# Altium project BÀI_1.PrjPcb (part 2 of 2)

## Sheet Buck-Bost_2.SchDoc
size A4; SheetNumber: 8; SheetTotal: 10
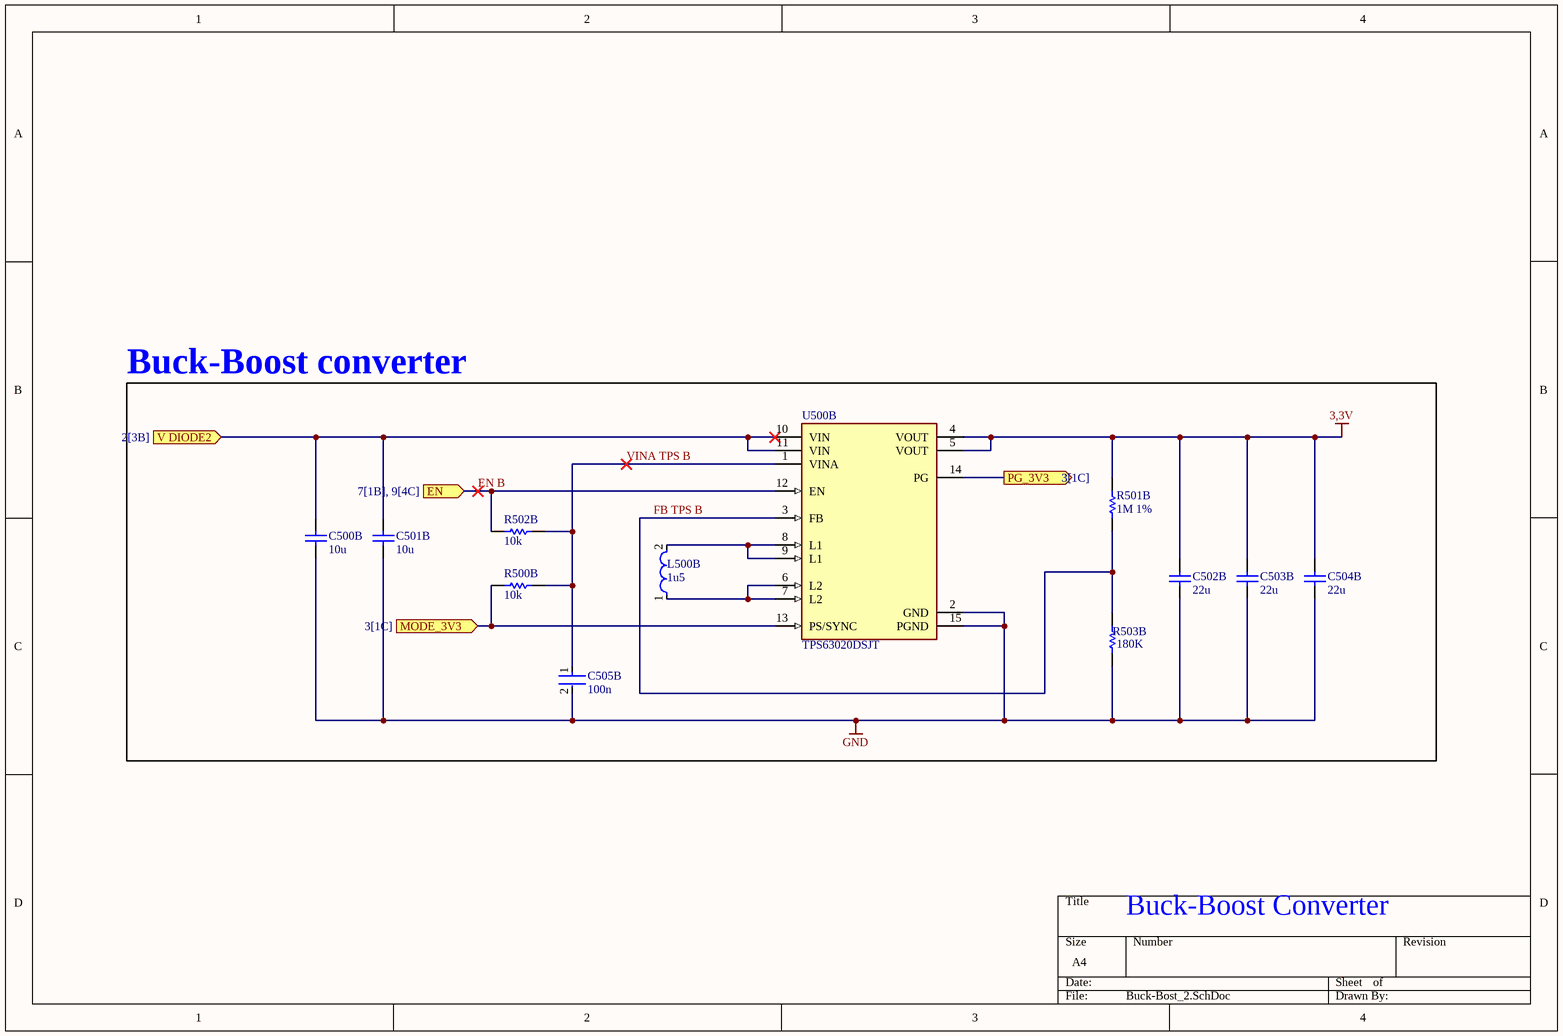
[diagram p7: Buck-Bost_2.SchDoc]

### Parts
C500B  10u  [CAPC3216X180X50LL20T25]
C501B  10u  [CAPC3216X180X50LL20T25]
C502B  22u  [CAPC1206(3216)190_L]
C503B  22u  [CAPC1206(3216)190_L]
C504B  22u  [CAPC1206(3216)190_L]
C505B  100n  [FP-CGA3E-0_3-0_1-IPC_A]
L500B  1u5  [FP-DFE252010C-IPC_A]
R500B  10k  [RESC2013X60X35NL10T20]
R501B  1M 1%  [RESC1608X55X25LL10T15]
R502B  10k  [RESC2013X60X35NL10T20]
R503B  180K  [RESC1005X40X25NL05T10]
U500B  TPS63020DSJT  [FP-DSJ0014A-MFG]

### Blocks framed on the sheet
Buck-Boost converter: C500B C501B C502B C503B C504B C505B L500B R500B R501B R502B R503B U500B

### Ports
EN (in, see 7[1B], 9[4C]), MODE_3V3 (in, see 3[1C]), PG_3V3 (out, see 3[1C]), V DIODE2 (in, see 2[3B])

### Nets
3,3V: C502B.2 C503B.2 C504B.2 R501B.2 U500B.4(VOUT) U500B.5(VOUT)
GND: C500B.1 C501B.1 C502B.1 C503B.1 C504B.1 C505B.2 R503B.1 U500B.2(GND) U500B.15(PGND)
EN B: R502B.1 U500B.12(EN) ; port EN
FB TPS B: R501B.1 R503B.2 U500B.3(FB)
VINA TPS B: C505B.1 R500B.2 R502B.2 U500B.1(VINA)
NetC401B_1: C500B.2 C501B.2 U500B.10(VIN) U500B.11(VIN) ; port V DIODE2
NetL500B_1: L500B.1 U500B.6(L2) U500B.7(L2)
NetL500B_2: L500B.2 U500B.8(L1) U500B.9(L1)
NetR500B_1: R500B.1 U500B.13(PS/SYNC) ; port MODE_3V3
NetU200_24: U500B.14(PG) ; port PG_3V3

### Notes on the sheet
- Buck-Boost Converter

### Library data of the parts
C500B C501B = CMP-2000-06013-1: Chip Capacitor, 10 uF, +/- 10%, 10 V, -55 to 125 degC, 1206 (3216 Metric), RoHS, Tape and Reel; Type: SMDMLCCX7R6.3-250VDCCommericalGrade; Class: Class1; Case Height: 1.6mm; Temperature Coefficient / Code: +/-15%; Capacitance: 10uF; Brand: Kemet; Case Length: 3.2mm; Dissipation Factor DF: 5; Voltage Rating: 10V; Dielectric: X7R; Tolerance: 10%; Package Reference: 1206; Dimensions: 1.6mmWx3.2mmLx1.6mmH; Series: C1206C; Minimum Operating Temperature: -55C; RoHS: Details; Termination Style: SMD/SMT; Mounting Technology: SurfaceMount; Manufacturer: Kemet; Product Category: MultilayerCeramicCapacitorsMLCC-SMD/SMT; Case Code - mm: 3216; Manufacturer URL: http://www.kemet.com/; Product: GeneralTypeMLCCs; Package Description: 2-Pin Surface Mount Device, Body 3.2 x 1.6 mm; Case Width: 1.6mm; Factory Pack Quantity: 2000; Package / Case: 1206(3216metric); Datasheet URL: http://www.kemet.com/docfinder?Partnumber=C1206C106K8RACTU; Datasheet Version: 02/2016; Operating Temperature Range: -55Cto+125C; Voltage Rating DC: 10V; Case Code - in: 1206; Maximum Operating Temperature: +125C; Packaging: Reel
C502B C503B C504B = CMP-1037-04986-1: CAP 22uF 6.3V ±20% 1206 (3216 Metric) Thickness 1.9mm SMD; Case-EIA: 1206; Tolerance: Â±20%; Case-Metric: 3216; Value: 22uF; Max Thickness: 1.9 mm; Rated Voltage: 6.3 V; Technology: SMT
C505B = CMP-2000-07546-2: Cap Ceramic 100nF 50V X7R 10% Pad SMD 0603 +125°C Automotive T/R; Weight: 7.1E-05oz; Composition: Ceramic; Max Operating Temperature: 125°C; Termination: SMD/SMT; Dielectric: X7R; Length: 1.6mm; Package Quantity: 1; REACH SVHC: No SVHC; Lead Free: Lead Free; Case Code (Metric): 1608; Min Operating Temperature: -55°C; Packaging: Tape and Reel; Tolerance: 10%; Voltage Rating: 50V; Case Code (Imperial): 0603; Capacitance: 100nF; Case/Package: 0603; Voltage Rating (DC): 50V; Depth: 0.8mm; Radiation Hardening: No; Ratings: AEC-Q200; Mount: Surface Mount; Voltage: 50V; Thickness: 0.035inch; Width: 0.8mm; Height: 0.8mm
L500B = CMP-06042-006286-1: Shielded Wirewound Inductor 1.5uH  2500mA 0.072Ω 1008 (2520); Current Rating: 2.5A; DC Resistance (DCR): 72mR; Core Material: Ferrite; Test Frequency: 1MHz; Saturation Current: 3.8A; Tolerance: 20%; Width: 0.079inch; Case Code (Metric): 2520; Case/Package: 1008; Height - Seated (Max): 0.039inch; Min Operating Temperature: -40°C; Inductance: 1.5uH; Case Code (Imperial): 1008; Shielding: Shielded; Mount: Surface Mount; Length: 0.098inch; Packaging: Tape and Reel; Max Operating Temperature: 125°C
R500B R502B = CMP-1659-00013-4: Chip Resistor, 10 KOhm, +/- 1%, 0.125 W, -55 to 155 degC, 0805 (2012 Metric), RoHS, Tape and Reel; Manufacturer: Yageo; Voltage Rating: 150 V; Mount: Surface Mount; ComponentLink1Description: Manufacturer URL; ComponentLink2URL: http://www.yageo.com/documents/recent/PYu-RC_Group_51_RoHS_L_04.pdf; Pins: 2; Length: 2 mm; Min Operating Temperature: -55 degC; Height: 0.5 mm; Mounting Technology: Surface Mount; RoHSCompliant: true; REACH SVHC: No SVHC; ComponentLink1URL: http://www.yageo.com/; Max Operating Temperature: 155 degC; PackageReference: 0805; DatasheetVersion: Rev. 4, 02/2016; Package Quantity: 5000; Packaging: Tape and Reel; ComponentLink2Description: Datasheet; PackageDescription: 2-Pin Surface Mounted Device, Body 2 x 1.25 mm
R501B = CMP-1659-00056-1: Chip Resistor, 1 MOhm, +/- 1%, 100 mW, -55 to 155 degC, 0603 (1608 Metric), RoHS, Tape and Reel; Voltage Rating (DC): 25 V; Tolerance: 20%; Case\Package: Radial; Capacitance: 1 mF; Min Operating Temperature: -40 degC; PackageDescription: 2-Pin Surface Mount Device, Body 1.6 x 0.8 mm; ComponentLink1Description: Manufacturer URL; Radiation Hardening: No; DatasheetVersion: Rev. 4, 02/2016; REACH SVHC: No SVHC; Length: 20 mm; Max Operating Temperature: 85 degC; Diameter: 10 mm; Packaging: Bulk; Package Quantity: 200; PackageReference: 0603; Mount: Through Hole; ComponentLink1URL: http://www.yageo.com/; ComponentLink2URL: http://www.yageo.com/documents/recent/PYu-RC_Group_51_RoHS_L_04.pdf; ComponentLink2Description: Datasheet; Width: 0 inch; Lead Pitch: 5 mm; RoHSCompliant: true; Voltage Rating: 25 V; Height: 20 mm
R503B = CMP-1011-00763-4: Chip Resistor, 180 KOhm, +/- 1%, 62.5 mW, -55 to 155 degC, 0402 (1005 Metric), RoHS, Tape and Reel; Manufacturer: Basic Passives; PartNumber: RC0402FR-07180KL; Power Rating: 62.5 mW; Voltage Rating: 50 V; Case\/Package: 0402; Length: 1 mm; RoHSCompliant: true; Mounting Technology: Surface Mount; Min Operating Temperature: -55 degC; PackageDescription: 2-Pin Surface Mount Device, Body 1 x 0.5 mm; Case Code (Imperial): 0402; Resistance: 180 KOhm; ComponentLink2URL: http://download.siliconexpert.com/pdfs/2016/1/13/0/45/27/830/yageo_/manual/8727809758379137pyu-rc_group_51_rohs_l___3.pdf; Packaging: Tape and Reel; Tolerance: 1%; Width: 0.5 mm; PackageReference: 0402; Max Operating Temperature: 155 degC; Package Quantity: 200; Height: 0.35 mm; Mount: Surface Mount; Pins: 2; DatasheetVersion: 12/2015; ComponentLink1URL: http://www.yageo.com/; ComponentLink1Description: Manufacturer URL; Case Code (Metric): 1005; REACH SVHC: No SVHC; ComponentLink2Description: Datasheet
U500B = CMP-2000-07282-2: IC REG BCK BST ADJ 3.5A 14VSON; Manufacturer: Texas Instruments; Switching Frequency: 2400kHz; Output Voltage: 1.2-5.5V; Nominal Supply Current: 25uA; Standoff Height: 0mm; Switching Topology: Buck-Boost; Min Supply Voltage: 1.8V; Output Type: AdjustableProgrammable; Max Junction Temp: +125°C; Number Of Outputs: 1; Output Current: 3A; Max Supply Voltage: 5.5V; ComponentLink2URL: https://www.ti.com/lit/ds/symlink/tps63020.pdf; Ambient Temperature Range High: +85°C; Digikey Description: IC REG BCK BST ADJ 3.5A 14VSON; Ambient Temperature Range Low: -40°C; Manufacturer Part Number: TPS63020DSJT; Automotive: No; Package: DSJ0014A; Category: IC; Temperature Range High: +85°C; Temperature: -40°C to +85°C; Octopart: https://octopart.com/tps63020dsjt-texas+instruments-12976119; Temperature Range Low: -40°C; Device Class L3: Voltage Regulators - Switching; Device Class L2: Power Management ICs; RoHS: TRUE; Lead Free: Yes; Height: 1mm; Device Class L1: Integrated Circuits (ICs); Mouser Description: Voltage Regulators - Switching Regulators 93% Eff Buck-Boost Converter; ComponentLink2Description: Datasheet

## Sheet Board_Connect.SchDoc
size A4; SheetNumber: 10; SheetTotal: 10
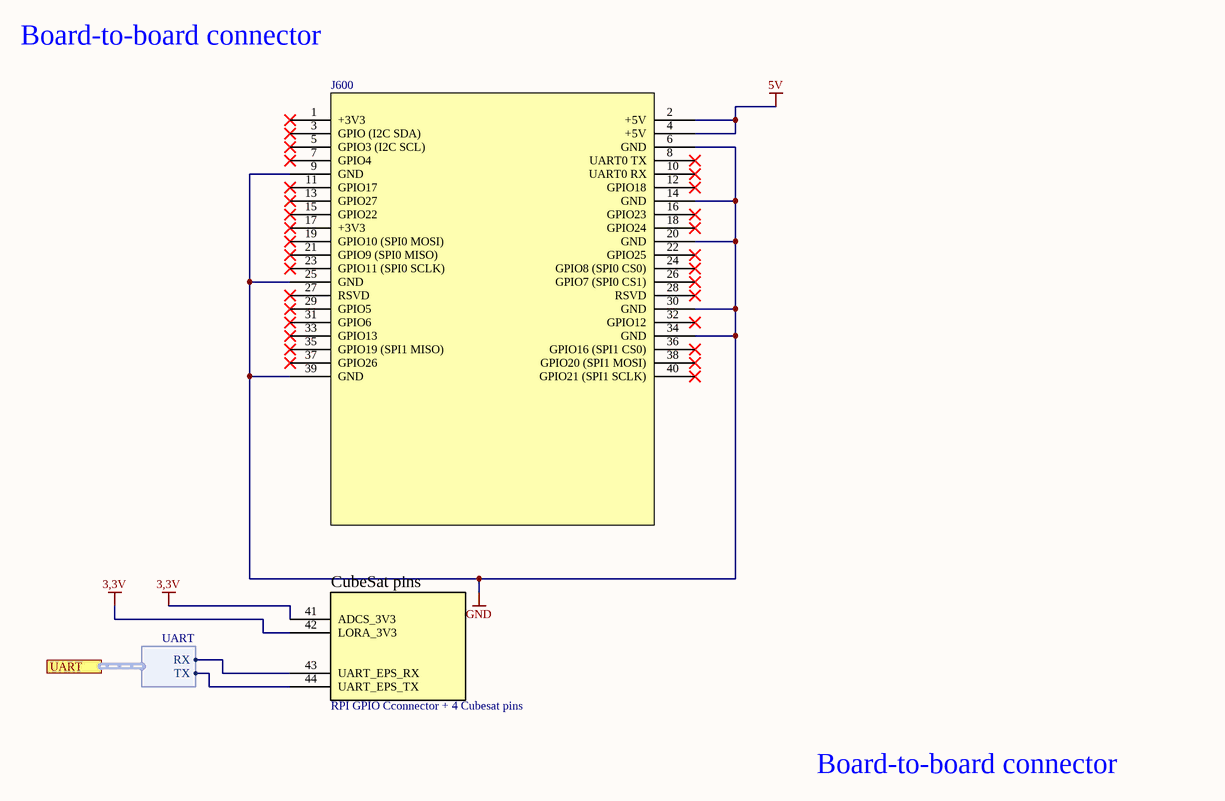
[diagram p8: Board_Connect.SchDoc]

### Parts
J600  RPI GPIO Cconnector + 4 Cubesat pins  [RPI GPIO]

### Ports
UART (harness UART, see 1[5C], 1[7B], 3[2C])

### Harnesses
UART: RX, TX

### Nets
3,3V: J600.41(ADCS_3V3) J600.42(LORA_3V3)
5V: J600.2(+5V) J600.4(+5V)
GND: J600.6(GND) J600.9(GND) J600.14(GND) J600.20(GND) J600.25(GND) J600.30(GND) J600.34(GND) J600.39(GND)
RX: J600.43(UART_EPS_RX) ; port UART.RX
TX: J600.44(UART_EPS_TX) ; port UART.TX

Not connected (* = marked no-connect by the designer): J600 1(+3V3)* 3(GPIO_(I2C_SDA))* 5(GPIO3_(I2C_SCL))* 7(GPIO4)* 8(UART0_TX)* 10(UART0_RX)* 11(GPIO17)* 12(GPIO18)* 13(GPIO27)* 15(GPIO22)* 16(GPIO23)* 17(+3V3)* 18(GPIO24)* 19(GPIO10_(SPI0_MOSI))* 21(GPIO9_(SPI0_MISO))* 22(GPIO25)* 23(GPIO11_(SPI0_SCLK))* 24(GPIO8_(SPI0_CS0))* 26(GPIO7_(SPI0_CS1))* 27(RSVD)* 28(RSVD)* 29(GPIO5)* 31(GPIO6)* 32(GPIO12)* 33(GPIO13)* 35(GPIO19_(SPI1_MISO))* 36(GPIO16_(SPI1_CS0))* 37(GPIO26)* 38(GPIO20_(SPI1_MOSI))* 40(GPIO21_(SPI1_SCLK))*

### Notes on the sheet
- Board-to-board connector
- (in symbol Connector GPIO) CubeSat pins

### Library data of the parts
J600 = Connector GPIO

## Sheet LED_CONNECTOR.SchDoc
size A4; SheetNumber: 9; SheetTotal: 10
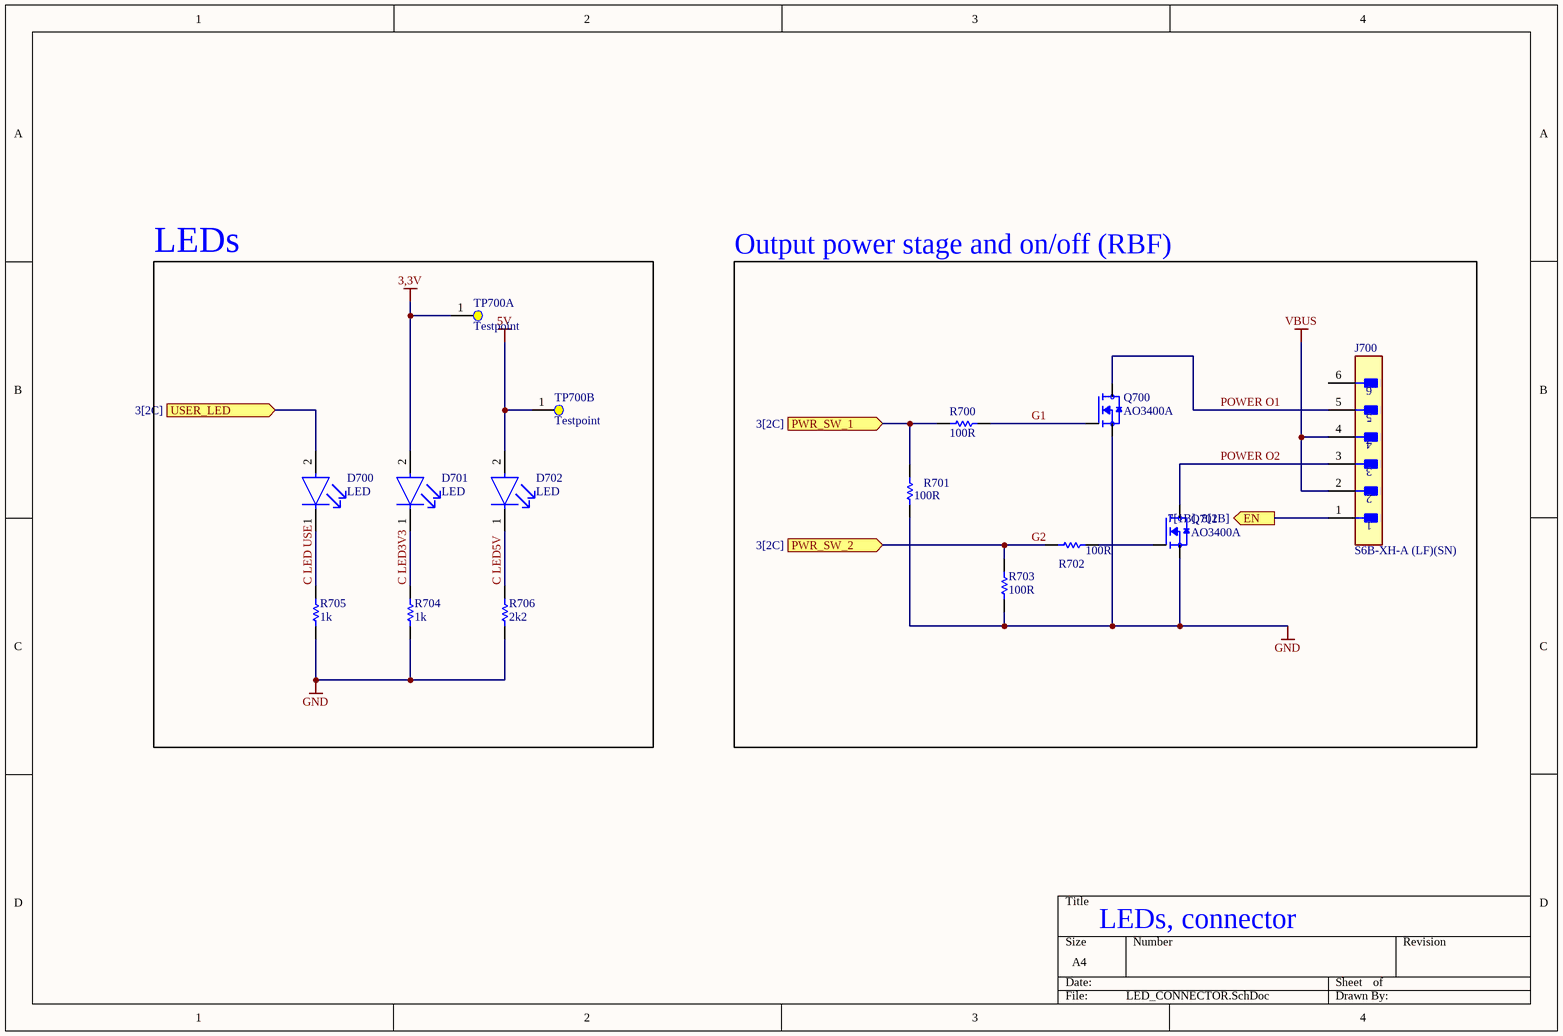
[diagram p9: LED_CONNECTOR.SchDoc]

### Parts
D700  LED  [FP-HSMG-C150-MFG]
D701  LED  [FP-HSMG-C150-MFG]
D702  LED  [FP-HSMG-C150-MFG]
J700  S6B-XH-A (LF)(SN)  [FP-S6B-XH-A_LF_SN-MFG]
Q700  AO3400A  [SOT95P280X125-3N]
Q701  AO3400A  [SOT95P280X125-3N]
R700  100R  [RESC1005X40X25ML05T10]
R701  100R  [RESC1609X50X30NL8T20]
R702  100R  [RESC1005X40X25ML05T10]
R703  100R  [RESC1609X50X30NL8T20]
R704  1k  [RESC2013X70X40LL20T20]
R705  1k  [RESC2013X70X40LL20T20]
R706  2k2  [RESC1609X50X30NL10T20]
TP700A  Testpoint  [Testpoint]
TP700B  Testpoint  [Testpoint]

### Blocks framed on the sheet
LEDs: D700-D702 R704-R706 TP700A TP700B
Output power stage and on/off (RBF): J700 Q700 Q701 R700-R703

### Ports
EN (out, see 7[1B], 8[2B]), PWR_SW_1 (in, see 3[2C]), PWR_SW_2 (in, see 3[2C]), USER_LED (in, see 3[2C])

### Nets
3,3V: D701.2(A) TP700A.1
5V: D702.2(A) TP700B.1
GND: Q700.2(S) Q701.2(S) R701.1 R703.1 R704.1 R705.1 R706.1
VBUS: J700.2 J700.4
C LED3V3: D701.1(C) R704.2
C LED5V: D702.1(C) R706.2
C LED USE: D700.1(C) R705.2
EN B: J700.1 ; port EN
G1: Q700.1(G) R700.2
G2: R702.1 R703.2 ; port PWR_SW_2
POWER O1: J700.5 Q700.3(D)
POWER O2: J700.3 Q701.3(D)
NetD700_2: D700.2(A) ; port USER_LED
NetQ701_1: Q701.1(G) R702.2
NetR700_1: R700.1 R701.2 ; port PWR_SW_1

Not connected (* = marked no-connect by the designer): J700 6

### Notes on the sheet
- LEDs, connector

### Library data of the parts
D700-D702 = CMP-2000-05061-2: LED GREEN DIFFUSED 1206 SMD; Manufacturer Part Number: HSMG-C150; Manufacturer: Broadcom; Led Orientation: Top View; Max Junction Temp: +95°C; Peak Emmision Wavelength: 570nm; Viewing Angle: 170°; Wavelength: 572nm; Reverse Voltage: 5V; Luminous Intensity: 15mcd; Forward Voltage: 2.2V; Power Dissipation: 65mW; Forward Current: 20mA; ComponentLink2Description: Datasheet; Lead Free: Yes; Temperature Range Low: -40°C; Package: HSMG-C150; Digikey Description: LED GREEN DIFFUSED 1206 SMD; Mouser Description: LED Uni-Color Green 570nm 2-Pin Chip LED T/R; Temperature Range High: +85°C; Device Class L1: Optoelectronics; Colour: Green; Category: Diode; Device Class L3: unset; RoHS: TRUE; Height: 1.2mm; ComponentLink2URL: https://docs.broadcom.com/docs/AV02-0551EN; Device Class L2: LEDs; Automotive: No; Ipc Land Pattern Name: DIOCP320160X55; Octopart: https://octopart.com/hsmg-c150-broadcom-71131304; Temperature: -40°C to +85°C
J700 = CMP-17439-000165-2: CONN HEADER R/A 6POS 2.5MM; Number of Contacts: 6; Contact Resistance: 20mR; Max Current Rating: 3A; Max Voltage Rating (AC): 250V; Gender: Male; Insulation Resistance: 1GR; Wire/Cable Gauge: 22AWG; Fastening Type: Detent; Lead Pitch: 2.5mm; Flammability Rating: UL94 V-0; Contact Finish - Mating: TIN; Housing Material: Polyamide; Length: 17.4mm; Termination: Solder; Contact Type: Male Pin; Number of Positions: 6; Mount: Through Hole; Orientation: Right Angle; Voltage Rating (AC): 250V; Contact Shape: Square; Lead Free: Lead Free; Insulation Material: Nylon; Insulation Color: Natural; Contact Plating: Tin; Connector Type: Header; Housing Color: White; Color: Natural; Package Quantity: 500; Contact Material: Brass; Packaging: Bulk; Pitch: 2.5mm; Series: XH; Number of Rows: 1; Min Operating Temperature: -25°C; Voltage Rating: 250V; REACH SVHC: No SVHC; Current Rating: 3A; Depth: 11.5mm; Max Operating Temperature: 85°C
Q700 Q701 = AO3400A: Trans MOSFET N-CH 30V 5.7A 3-Pin SOT-23; Package: None; Price: None; Availability: Unavailable; MP: AO3400A; Value: *
R700 R702 = CMP-2002-07344-1: Part Number: RC0402FR-07100RL; Manufacturer: Yageo / Phycomp
R701 R703 = CMP-1666-00005-4: Chip Resistor, 10 KOhm, +/- 1%, 100 mW, -55 to 155 degC, 0603 (1608 Metric), RoHS, Tape and Reel; Manufacturer: Vishay Semiconductor; Voltage Rating: 75 V; Max Operating Temperature: 155 degC; PackageDescription: 2-Pin Surface Mount Device, Body 1.575 x 0.85 mm; ComponentLink1Description: Manufacturer URL; RoHSCompliant: true; PackageReference: 0603; REACH SVHC: Unknown; Length: 1.55 mm; DatasheetVersion: 06/2012; Packaging: Tape and Reel; Min Operating Temperature: -55 degC; Mounting Technology: Surface Mount; ComponentLink2URL: https://datasheet.ciiva.com/11809/0900766b80d98afc-11809037.pdf; Height: 0.45 mm; ComponentLink2Description: Datasheet; Package Quantity: 5000; ComponentLink1URL: http://www.vishay.com/
R704 R705 = CMP-2001-04375-5: Chip Resistor, 1 KOhm, +/- 1%, 0.125 W, -55 to 155 degC, 0805 (2012 Metric), RoHS, Tape and Reel; Manufacturer: Panasonic; Voltage Rating: 150 V; ComponentLink1URL: http://www.panasonic.com/; ComponentLink2Description: Datasheet; REACH SVHC: Yes; ComponentLink1Description: Manufacturer URL; Length: 2 mm; Height: 0.6 mm; Package Quantity: 1; PackageDescription: 2-Pin Surface Mount Device, Body 2 x 1.25 mm; Packaging: Cut Tape; PackageReference: 0805; Max Operating Temperature: 155 degC; Mounting Technology: Surface Mount; ComponentLink2URL: http://industrial.panasonic.com/cdbs/www-data/pdf/RDA0000/AOA0000C86.pdf; DatasheetVersion: 04/2015; Min Operating Temperature: -55 degC; RoHSCompliant: true; Mount: Surface Mount
R706 = CMP-2000-03167-1: Part Number: CRCW06032K20FKEA; Manufacturer: Vishay Dale

## Nets that join several sheets
3,3V: MICROCONTROLER (15 pins), Buck-Bost_2 (6 pins), Board_Connect (J600.41 J600.42), LED_CONNECTOR (D701.2 TP700A.1)
5V: Buck-Boost_1 (6 pins), Board_Connect (J600.2 J600.4), LED_CONNECTOR (D702.2 TP700B.1)
GND: MICROCONTROLER (31 pins), MPPT_1 (16 pins), MPPT_2 (16 pins), IDEAL_DIODE_1 (C400A.2 C401A.2 U400A.2 U400A.3), IDEAL_DIODE_2 (C400B.2 C401B.2 U400B.2 U400B.3), Buck-Boost_1 (9 pins), Buck-Bost_2 (9 pins), Board_Connect (8 pins), LED_CONNECTOR (7 pins)
EN B: Buck-Boost_1 (R502A.1 U500A.12), Buck-Bost_2 (R502B.1 U500B.12), LED_CONNECTOR (J700.1)
G2: MICROCONTROLER (U200.34), LED_CONNECTOR (R702.1 R703.2)
Net?_2: MICROCONTROLER (R200.2), MPPT_1 (10 pins), IDEAL_DIODE_1 (C400A.1 Q400A.3 U400A.1)
NetC303B_1: MICROCONTROLER (R201.2), MPPT_2 (10 pins), IDEAL_DIODE_2 (C400B.1 Q400B.3 U400B.1)
NetC401B_1: IDEAL_DIODE_2 (C401B.1 Q400B.2 U400B.6), Buck-Bost_2 (C500B.2 C501B.2 U500B.10 U500B.11)
NetD700_2: MICROCONTROLER (U200.54), LED_CONNECTOR (D700.2)
NetR302A_1: MICROCONTROLER (U200.11), MPPT_1 (R302A.1 U300A.1)
NetR500A_1: MICROCONTROLER (U200.28), Buck-Boost_1 (R500A.1 U500A.13)
NetR500B_1: MICROCONTROLER (U200.25), Buck-Bost_2 (R500B.1 U500B.13)
NetR700_1: MICROCONTROLER (U200.35), LED_CONNECTOR (R700.1 R701.2)
NetU200_9: MICROCONTROLER (U200.9), MPPT_1 (U300A.23)
NetU200_10: MICROCONTROLER (U200.10), MPPT_2 (U300B.23)
NetU200_24: MICROCONTROLER (U200.24), Buck-Bost_2 (U500B.14)
NetU200_27: MICROCONTROLER (U200.27), Buck-Boost_1 (U500A.14)
PG: MICROCONTROLER (U200.58), MPPT_1 (U300A.19)
PG B: MICROCONTROLER (U200.59), MPPT_2 (U300B.19)
RX: MICROCONTROLER (U200.30), Board_Connect (J600.43)
TX: MICROCONTROLER (U200.29), Board_Connect (J600.44)
V DIODE1: IDEAL_DIODE_1 (C401A.1 Q400A.2 U400A.6), Buck-Boost_1 (C500A.2 C501A.2 U500A.10 U500A.11)